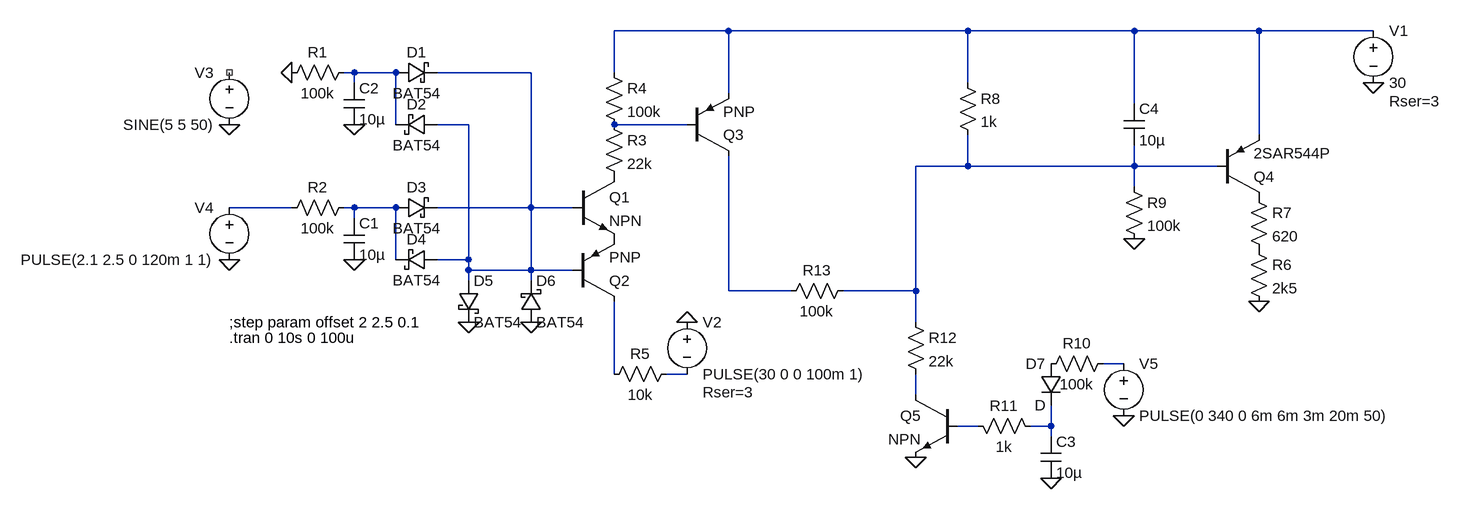
[diagram p0: schematic DC_detection.asc]
DC_detection.asc, the LTspice schematic file:
Version 4
SHEET 1 2640 724
WIRE 672 16 496 16
WIRE 1040 16 672 16
WIRE 1296 16 1040 16
WIRE 1488 16 1296 16
WIRE 1664 16 1488 16
WIRE 96 80 80 80
WIRE 160 80 96 80
WIRE 368 80 224 80
WIRE 496 80 496 16
WIRE 96 96 96 80
WIRE 1040 96 1040 16
WIRE 672 112 672 16
WIRE 1296 128 1296 16
WIRE 160 160 160 80
WIRE 272 160 224 160
WIRE 608 160 496 160
WIRE 1488 176 1488 16
WIRE 1040 224 1040 176
WIRE 1040 224 960 224
WIRE 1296 224 1296 192
WIRE 1296 224 1040 224
WIRE 1424 224 1296 224
WIRE 1296 256 1296 224
WIRE 0 288 -96 288
WIRE 96 288 80 288
WIRE 160 288 96 288
WIRE 368 288 368 80
WIRE 368 288 224 288
WIRE 432 288 368 288
WIRE 96 304 96 288
WIRE 160 368 160 288
WIRE 272 368 272 160
WIRE 272 368 224 368
WIRE 272 384 272 368
WIRE 368 384 368 288
WIRE 368 384 272 384
WIRE 432 384 368 384
WIRE 272 400 272 384
WIRE 368 400 368 384
WIRE 672 416 672 208
WIRE 768 416 672 416
WIRE 960 416 960 224
WIRE 960 416 848 416
WIRE 960 464 960 416
WIRE 1280 528 1248 528
WIRE 496 544 496 432
WIRE 608 544 576 544
WIRE 960 576 960 544
WIRE 1056 624 1024 624
WIRE 1168 624 1168 592
WIRE 1168 624 1136 624
WIRE 1168 640 1168 624
FLAG 96 160 0
FLAG 96 368 0
FLAG 272 464 0
FLAG 368 464 0
FLAG 608 464 0
FLAG -96 368 0
FLAG -96 160 0
FLAG 1664 96 0
FLAG 1280 608 0
FLAG 1168 704 0
FLAG 960 672 0
FLAG 1488 432 0
FLAG 0 80 0
FLAG 1296 336 0
SYMBOL res 96 64 R90
WINDOW 0 0 56 VBottom 2
WINDOW 3 32 56 VTop 2
SYMATTR InstName R1
SYMATTR Value 100k
SYMBOL res 96 272 R90
WINDOW 0 0 56 VBottom 2
WINDOW 3 32 56 VTop 2
SYMATTR InstName R2
SYMATTR Value 100k
SYMBOL cap 80 304 R0
SYMATTR InstName C1
SYMATTR Value 10µ
SYMBOL cap 80 96 R0
SYMATTR InstName C2
SYMATTR Value 10µ
SYMBOL npn 432 240 R0
SYMATTR InstName Q1
SYMBOL pnp 432 432 M180
SYMATTR InstName Q2
SYMBOL pnp 608 208 M180
SYMATTR InstName Q3
SYMBOL res 480 144 R0
SYMATTR InstName R3
SYMATTR Value 22k
SYMBOL res 480 64 R0
SYMATTR InstName R4
SYMATTR Value 100k
SYMBOL voltage 1664 0 R0
WINDOW 123 0 0 Left 0
WINDOW 39 24 124 Left 2
SYMATTR InstName V1
SYMATTR Value 30
SYMATTR SpiceLine Rser=3
SYMBOL voltage 608 448 R0
WINDOW 123 0 0 Left 0
WINDOW 39 24 124 Left 2
SYMATTR InstName V2
SYMATTR Value PULSE(30 0 0 100m 1)
SYMATTR SpiceLine Rser=3
SYMBOL res 592 528 R90
WINDOW 0 0 56 VBottom 2
WINDOW 3 32 56 VTop 2
SYMATTR InstName R5
SYMATTR Value 10k
SYMBOL voltage -96 64 M0
WINDOW 123 0 0 Left 0
WINDOW 39 0 0 Left 0
SYMATTR InstName V3
SYMATTR Value SINE(5 5 50)
SYMBOL voltage -96 272 M0
WINDOW 123 0 0 Left 0
WINDOW 39 0 0 Left 0
SYMATTR InstName V4
SYMATTR Value PULSE(2.1 2.5 0 120m 1 1)
SYMBOL res 1472 336 R0
SYMATTR InstName R6
SYMATTR Value 2k5
SYMBOL res 1472 256 R0
SYMATTR InstName R7
SYMATTR Value 620
SYMBOL voltage 1280 512 R0
WINDOW 123 0 0 Left 0
WINDOW 39 0 0 Left 0
SYMATTR InstName V5
SYMATTR Value PULSE(0 340 0 6m 6m 3m 20m 50)
SYMBOL res 1264 512 R90
WINDOW 0 0 56 VBottom 2
WINDOW 3 32 56 VTop 2
SYMATTR InstName R10
SYMATTR Value 100k
SYMBOL diode 1184 528 M0
SYMATTR InstName D7
SYMBOL cap 1152 640 R0
SYMATTR InstName C3
SYMATTR Value 10µ
SYMBOL npn 1024 576 M0
SYMATTR InstName Q5
SYMBOL res 1152 640 M270
WINDOW 0 32 56 VTop 2
WINDOW 3 0 56 VBottom 2
SYMATTR InstName R11
SYMATTR Value 1k
SYMBOL res 944 448 R0
SYMATTR InstName R12
SYMATTR Value 22k
SYMBOL pnp 1424 272 M180
SYMATTR InstName Q4
SYMATTR Value 2SAR544P
SYMBOL schottky 160 96 R270
WINDOW 0 32 32 VTop 2
WINDOW 3 0 32 VBottom 2
SYMATTR InstName D1
SYMATTR Value BAT54
SYMBOL schottky 224 144 R90
WINDOW 0 0 32 VBottom 2
WINDOW 3 32 32 VTop 2
SYMATTR InstName D2
SYMATTR Value BAT54
SYMBOL schottky 160 304 R270
WINDOW 0 32 32 VTop 2
WINDOW 3 0 32 VBottom 2
SYMATTR InstName D3
SYMATTR Value BAT54
SYMBOL schottky 224 352 R90
WINDOW 0 0 32 VBottom 2
WINDOW 3 32 32 VTop 2
SYMATTR InstName D4
SYMATTR Value BAT54
SYMBOL schottky 256 400 R0
SYMATTR InstName D5
SYMATTR Value BAT54
SYMBOL schottky 352 464 M180
WINDOW 0 24 64 Left 2
WINDOW 3 24 0 Left 2
SYMATTR InstName D6
SYMATTR Value BAT54
SYMBOL res 1024 80 R0
SYMATTR InstName R8
SYMATTR Value 1k
SYMBOL cap 1280 128 R0
SYMATTR InstName C4
SYMATTR Value 10µ
SYMBOL res 864 400 R90
WINDOW 0 0 56 VBottom 2
WINDOW 3 32 56 VTop 2
SYMATTR InstName R13
SYMATTR Value 100k
SYMBOL res 1280 240 R0
SYMATTR InstName R9
SYMATTR Value 100k
TEXT -96 488 Left 2 !.tran 0 10s 0 100u
TEXT -96 464 Left 2 !;step param offset 2 2.5 0.1

The netlist it stands for:
* DC_detection.asc
R1 N002 0 100k
R2 N007 N006 100k
C1 N007 0 10µ
C2 N002 0 10µ
Q1 P001 N003 P002 0 NPN
Q2 N010 N003 P002 0 PNP
Q3 N008 N004 N001 0 PNP
R3 N004 P001 22k
R4 N001 N004 100k
V1 N001 0 30 Rser=3
V2 0 N011 PULSE(30 0 0 100m 1) Rser=3
R5 N011 N010 10k
V3 NC_01 0 SINE(5 5 50)
V4 N006 0 PULSE(2.1 2.5 0 120m 1 1)
R6 P003 0 2k5
R7 P004 P003 620
V5 N009 0 PULSE(0 340 0 6m 6m 3m 20m 50)
R10 N009 P005 100k
D7 P005 N014 D
C3 N014 0 10µ
Q5 N012 N013 0 0 NPN
R11 N014 N013 1k
R12 N005 N012 22k
Q4 P004 N005 N001 0 2SAR544P
D1 N002 N003 BAT54
D2 N003 N002 BAT54
D3 N007 N003 BAT54
D4 N003 N007 BAT54
D5 N003 0 BAT54
D6 0 N003 BAT54
R8 N001 N005 1k
C4 N001 N005 10µ
R13 N005 N008 100k
R9 N005 0 100k
.model D D
.lib standard.dio
.model NPN NPN
.model PNP PNP
.lib standard.bjt
.tran 0 10s 0 100u
;step param offset 2 2.5 0.1
.backanno
.end